# EAGLE design 7segement4digits1badidea-huge-digits-mk-1.1 (EAGLE 7.5.0)
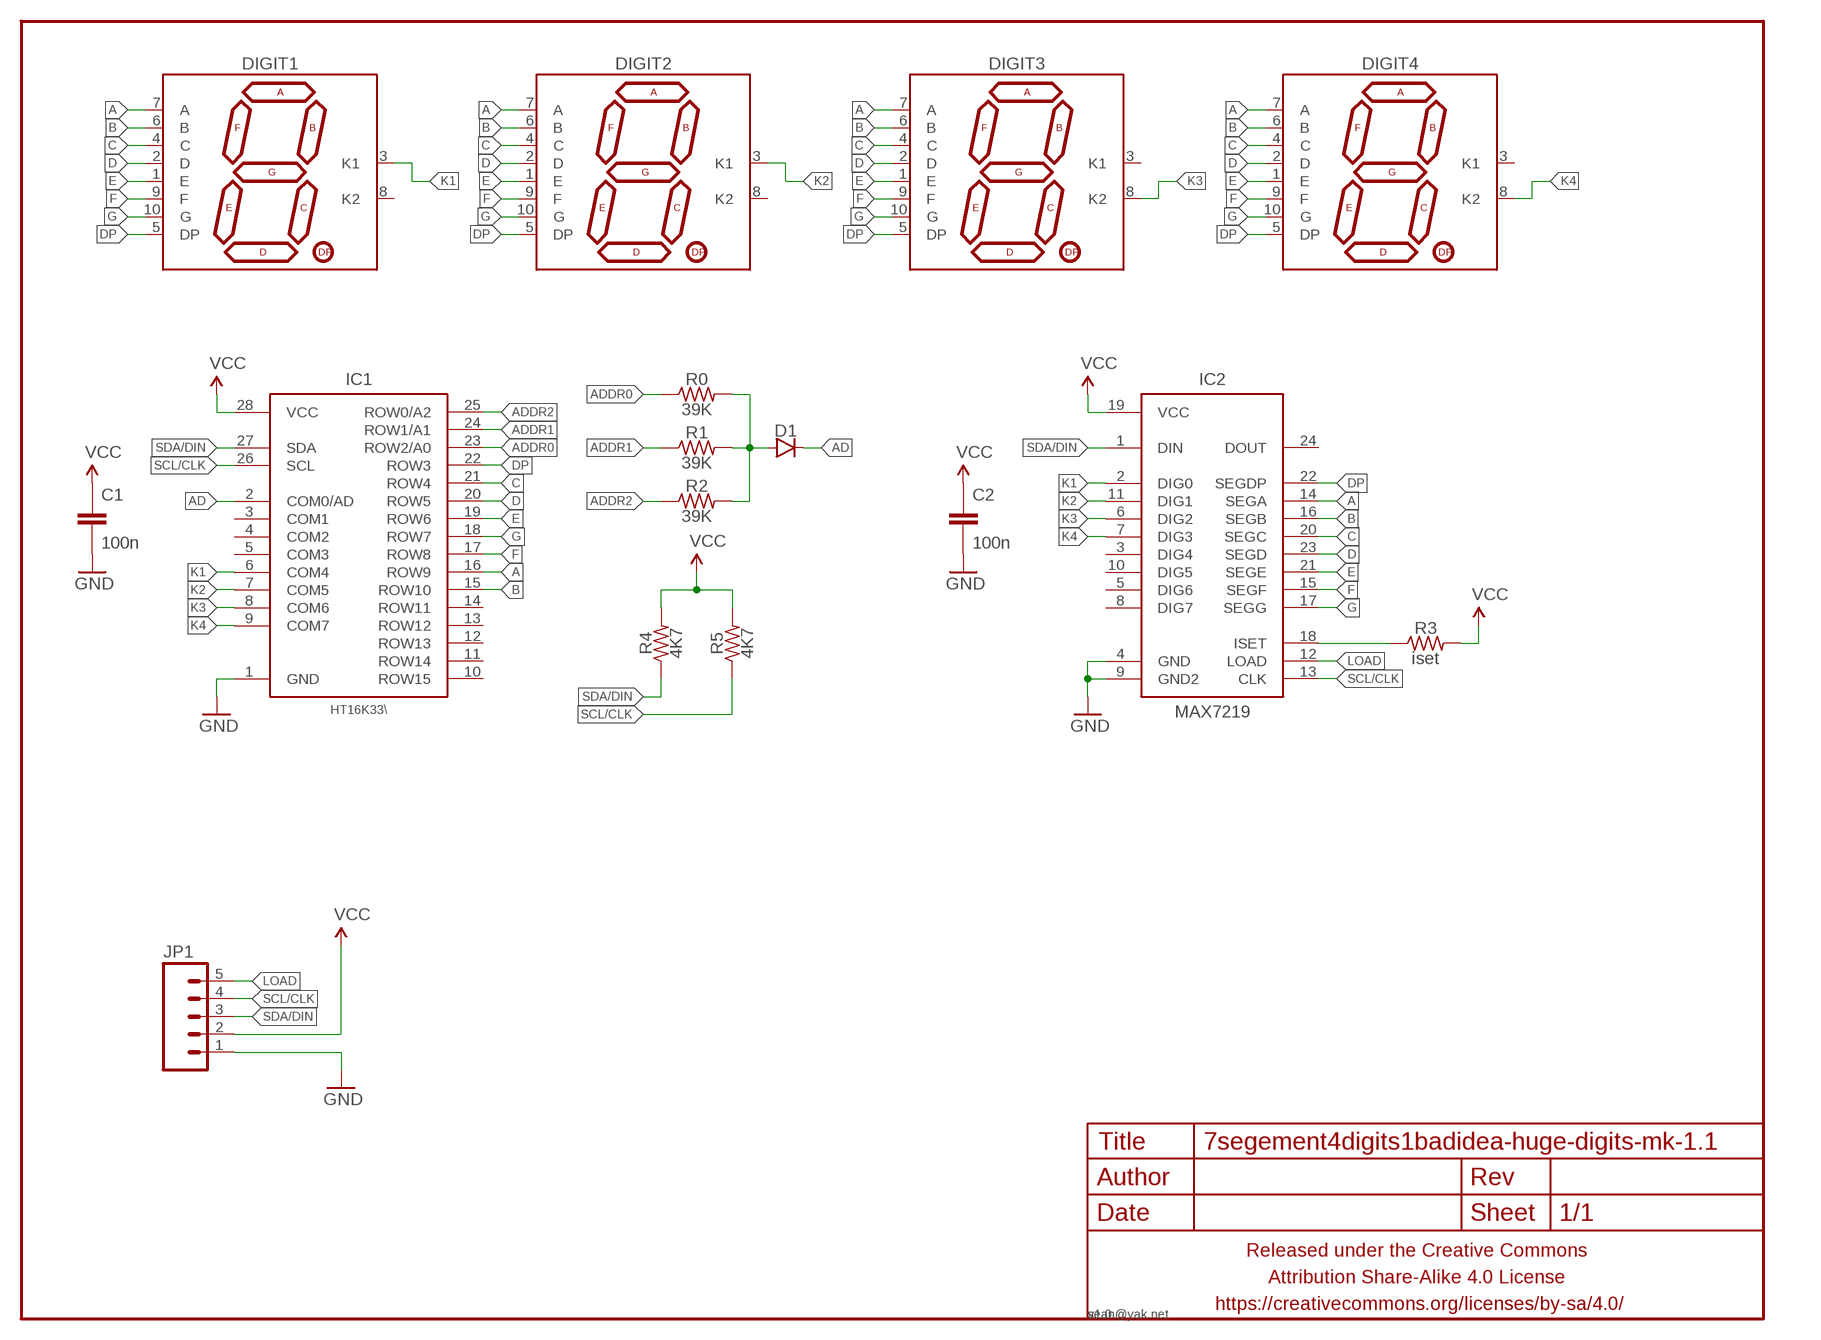
[diagram p0: schematic, sheet 1]

## Parts
C1  100n  CAPACITOR-CERAMICC0805  [C0805]
C2  100n  CAPACITOR-CERAMICC0805  [C0805]
D1  DIODESOD123  [SOD123]
DIGIT1  7SEG_1DIGPTH-25.4MM  [7SEG_1DIG_25.4MM]
DIGIT2  7SEG_1DIGPTH-25.4MM  [7SEG_1DIG_25.4MM]
DIGIT3  7SEG_1DIGPTH-25.4MM  [7SEG_1DIG_25.4MM]
DIGIT4  7SEG_1DIGPTH-25.4MM  [7SEG_1DIG_25.4MM]
FRAME1  FRAME-LETTERNO_PACKAGE  [DUMMY]
IC1  HT16K33\  HT16K33-28SOIC28W  [SOIC28W]
IC2  MAX7219  MAX7219SOIC-W  [SO24W]
JP1  M05PTH-CENTERED  [1X05_PTH_CENTERED]
R0  39K  RESISTORR0805  [R0805]
R1  39K  RESISTORR0805  [R0805]
R2  39K  RESISTORR0805  [R0805]
R3  iset  RESISTORR0805  [R0805]
R4  4K7  RESISTORR0805  [R0805]
R5  4K7  RESISTORR0805  [R0805]

## Nets
A: DIGIT1.7(A) DIGIT2.7(A) DIGIT3.7(A) DIGIT4.7(A) IC1.16(ROW9) IC2.14(SEGA)
AD: D1.C IC1.2(COM0/AD)
ADDR0: IC1.23(ROW2/A0) R0.1
ADDR1: IC1.24(ROW1/A1) R1.1
ADDR2: IC1.25(ROW0/A2) R2.1
B: DIGIT1.6(B) DIGIT2.6(B) DIGIT3.6(B) DIGIT4.6(B) IC1.15(ROW10) IC2.16(SEGB)
C: DIGIT1.4(C) DIGIT2.4(C) DIGIT3.4(C) DIGIT4.4(C) IC1.21(ROW4) IC2.20(SEGC)
D: DIGIT1.2(D) DIGIT2.2(D) DIGIT3.2(D) DIGIT4.2(D) IC1.20(ROW5) IC2.23(SEGD)
DP: DIGIT1.5(DP) DIGIT2.5(DP) DIGIT3.5(DP) DIGIT4.5(DP) IC1.22(ROW3) IC2.22(SEGDP)
E: DIGIT1.1(E) DIGIT2.1(E) DIGIT3.1(E) DIGIT4.1(E) IC1.19(ROW6) IC2.21(SEGE)
F: DIGIT1.9(F) DIGIT2.9(F) DIGIT3.9(F) DIGIT4.9(F) IC1.17(ROW8) IC2.15(SEGF)
G: DIGIT1.10(G) DIGIT2.10(G) DIGIT3.10(G) DIGIT4.10(G) IC1.18(ROW7) IC2.17(SEGG)
GND: C1.2 C2.2 IC1.1(GND) IC2.4(GND) IC2.9(GND2) JP1.1
K1: DIGIT1.3(K1) IC1.6(COM4) IC2.2(DIG0)
K2: DIGIT2.3(K1) IC1.7(COM5) IC2.11(DIG1)
K3: DIGIT3.8(K2) IC1.8(COM6) IC2.6(DIG2)
K4: DIGIT4.8(K2) IC1.9(COM7) IC2.7(DIG3)
LOAD: IC2.12(LOAD) JP1.5
N$1: IC2.18(ISET) R3.1
N$2: D1.A R0.2 R1.2 R2.2
SCL/CLK: IC1.26(SCL) IC2.13(CLK) JP1.4 R5.1
SDA/DIN: IC1.27(SDA) IC2.1(DIN) JP1.3 R4.1
VCC: C1.1 C2.1 IC1.28(VCC) IC2.19(VCC) JP1.2 R3.2 R4.2 R5.2
Unconnected: DIGIT1.8(K2) DIGIT2.8(K2) DIGIT3.3(K1) DIGIT4.3(K1) IC1.3(COM1) IC1.4(COM2) IC1.5(COM3) IC1.10(ROW15) IC1.11(ROW14) IC1.12(ROW13) IC1.13(ROW12) IC1.14(ROW11) IC2.3(DIG4) IC2.5(DIG6) IC2.8(DIG7) IC2.10(DIG5) IC2.24(DOUT)

## Library data of the parts
C1 C2 = a_parts:CAPACITOR-CERAMIC: CAPACITOR, European symbol
D1 = a_parts:DIODE: Diode These are standard reverse protection diodes and small signal diodes. SMA package can handle up to about 1A. SOD-323 can handle about 200mA. What the SOD-323 package when ordering, there are some mfgs out there that are 5-pin packages.
DIGIT1-DIGIT4 = A_butts:7SEG_1DIG
FRAME1 = A_butts:FRAME-LETTER: Schematic Frame Standard 8.5x11 US Letter frame; DESIGNER: sean@yak.net; VERSION: v1.0
IC1 = a_parts:HT16K33-28
IC2 = a_parts:MAX7219: 8-digit, 8-segment LED display driver, serial input
JP1 = a_parts:M05: Header 5 Standard 5-pin 0.1" header. Use with straight break away headers (SKU : PRT-00116), right angle break away headers (PRT-00553), swiss pins (PRT-00743), machine pins (PRT-00117), and female headers (PRT-00115). Molex polarized connector foot print use with SKU : PRT-08230 with associated crimp pins and housings.
R0 R1-R5 = a_parts:RESISTOR: RESISTOR, American symbol

## Board
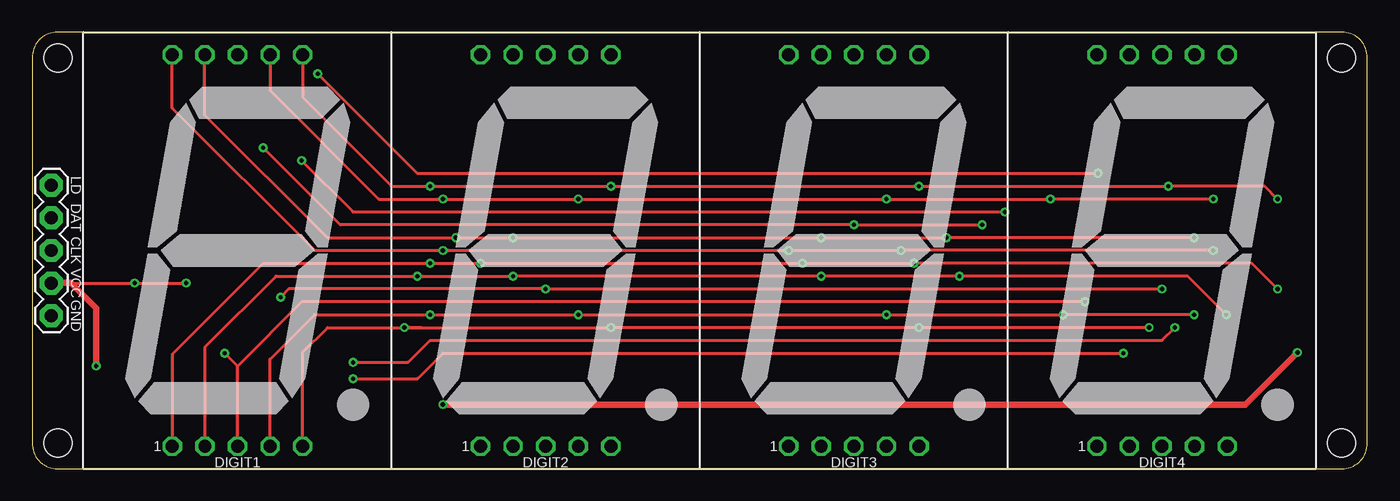
[diagram p1: board, top side]
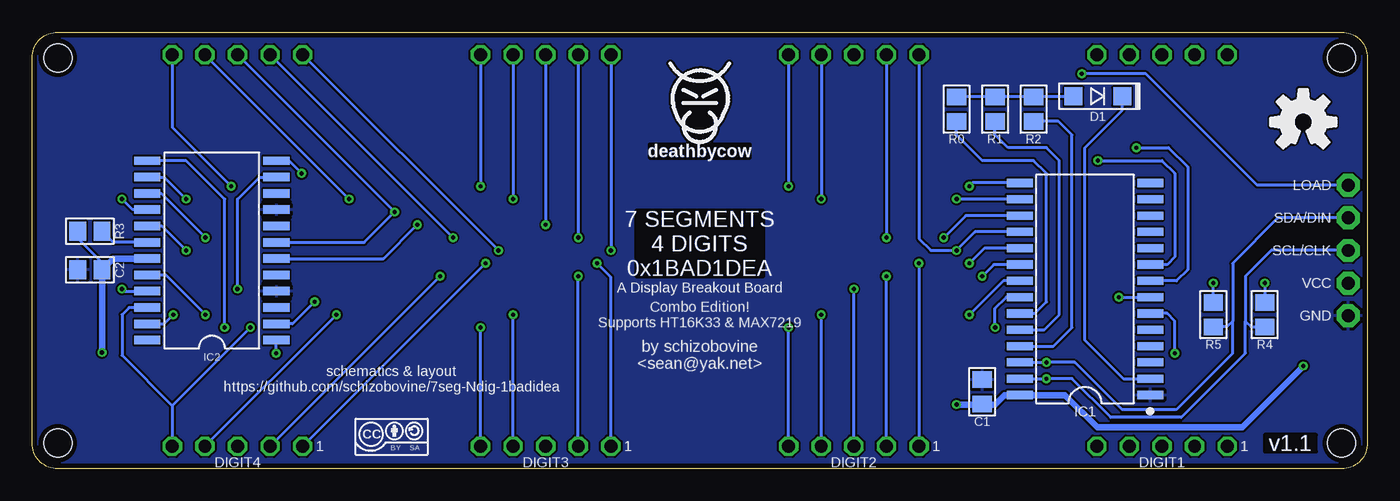
[diagram p2: board, bottom side, seen from below]

Size 104 x 34 mm. Coordinates in mm from the lower left corner, seen from the top.
Outline: 0,32 0,2 arc90 2,0 102,0 arc90 104,2 104,32 arc90 102,34 2,34 arc90 0,32
Copper layers (1*16): Top 0.0356mm / dielectric 1.5011mm / Bottom 0.0356mm
Design rules "LaenPCBOrder2": minimum track width 6mil, minimum drill 13mil, track to track 6mil, track to pad 6mil, pad to pad 6mil, via to via 6mil, smd to smd 6mil, copper to edge 15mil, drill to drill 6mil, minimum pad ring 7mil, minimum via ring 7mil, stop-mask expansion 3mil, vias tented up to drill 20mil, thermal gap 10mil
Holes 2.2 mm at 2,2 102,2 102,32 2,32
bRestrict: 4 lines

### Footprints (pad centres in the part's own frame; a part is rotated, then mirrored left to right if it is on the bottom)
C0805 = smd 1.3 x 1.5: 1 -0.95,0; 2 0.95,0
SOD123 = smd 1.4 x 1.4: A 1.9,0; C -1.9,0
7SEG_1DIG_25.4MM = drill 1 pad 1.5 octagon: 1 -5.08,-15.24; 2 -2.54,-15.24; 3 0,-15.24; 4 2.54,-15.24; 5 5.08,-15.24; 6 5.08,15.24; 7 2.54,15.24; 8 0,15.24; 9 -2.54,15.24; 10 -5.08,15.24
SOIC28W = smd 0.635 x 2.032: 1 -8.255,-5.08; 2 -6.985,-5.08; 3 -5.715,-5.08; 4 -4.445,-5.08; 5 -3.175,-5.08; 6 -1.905,-5.08; 7 -0.635,-5.08; 8 0.635,-5.08; 9 1.905,-5.08; 10 3.175,-5.08; 11 4.445,-5.08; 12 5.715,-5.08; 13 6.985,-5.08; 14 8.255,-5.08; 15 8.255,5.08; 16 6.985,5.08; 17 5.715,5.08; 18 4.445,5.08; 19 3.175,5.08; 20 1.905,5.08; 21 0.635,5.08; 22 -0.635,5.08; 23 -1.905,5.08; 24 -3.175,5.08; 25 -4.445,5.08; 26 -5.715,5.08; 27 -6.985,5.08; 28 -8.255,5.08
SO24W = smd 0.66 x 2.032: 1 -6.985,-5.029; 2 -5.715,-5.029; 3 -4.445,-5.029; 4 -3.175,-5.029; 5 -1.905,-5.029; 6 -0.635,-5.029; 7 0.635,-5.029; 8 1.905,-5.029; 9 3.175,-5.029; 10 4.445,-5.029; 11 5.715,-5.029; 12 6.985,-5.029; 13 6.985,5.029; 14 5.715,5.029; 15 4.445,5.029; 16 3.175,5.029; 17 1.905,5.029; 18 0.635,5.029; 19 -0.635,5.029; 20 -1.905,5.029; 21 -3.175,5.029; 22 -4.445,5.029; 23 -5.715,5.029; 24 -6.985,5.029
1X05_PTH_CENTERED = drill 1 pad 1.778 octagon: 1 -5.08,0; 2 -2.54,0; 3 0,0; 4 2.54,0; 5 5.08,0
R0805 = smd 1.3 x 1.5: 1 -0.95,0; 2 0.95,0

### Placement (x,y rotation side)
C1  30,6 90 bottom
C2  99.5,15.5 180 bottom
D1  21,29 180 bottom
DIGIT1  16,17 0 top
DIGIT2  40,17 0 top
DIGIT3  64,17 0 top
DIGIT4  88,17 0 top
FRAME1  0,0 0 top
IC1  22,14 90 bottom
IC2  90,17 90 bottom
JP1  1.5,17 90 top
R0  32,28 90 bottom
R1  29,28 90 bottom
R2  26,28 90 bottom
R3  99.5,18.5 180 bottom
R4  8,12 90 bottom
R5  12,12 90 bottom
U$1  [CC-BY-SA-4.0-NO-URL]  76,2.5 0 bottom
U$2  [COW_SMALL_METAL]  52,29 0 bottom
U$3  [OSHWLOGO_TOP_0.2_A]  5,27 0 bottom

### Tracks (layer width: path | path; a pad name or v marks a point on that pad's centre or on a via)
A  (via drill 0.33)
  Top 0.25: DIGIT1.7 18.54,29.46 27,21 v32,21 v42.54,21 v66.54,21 v79.3,21 v92,21
  Bottom 0.25: DIGIT4.7 v79.3,21 | DIGIT3.7 v66.54,21 | DIGIT2.7 v42.54,21 | IC1.16 31.98,20.98 v32,21 | IC2.14 93.72,22.71 v92,21
AD
  Bottom 0.25: IC1.2 19.02,7.01 22,10 22,25 19.1,27.9 D1.C
ADDR0
  Bottom 0.25: IC1.23 25.91,12.1 25,13 25,23 26,24 30,24 32,26 R0.1
ADDR1
  Bottom 0.25: IC1.24 25.18,10.82 24,12 24,24 25,25 28,25 29,26 R1.1
ADDR2
  Bottom 0.25: IC1.25 24.45,9.55 23,11 23,26 24.05,27.05 R2.1
B  (via drill 0.33)
  Top 0.25: DIGIT1.6 21.08,28.92 28,22 v31,22 v45.08,22 v69.08,22 v88.5,22 96,22 v97,21
  Bottom 0.25: DIGIT4.6 93.08,26.58 v88.5,22 | DIGIT3.6 v69.08,22 | DIGIT2.6 v45.08,22 | IC1.15 30.75,22.25 v31,22 | IC2.16 96.17,20.18 v97,21
C  (via drill 0.33)
  Top 0.25: DIGIT1.4 18.54,8.54 22,12 v31,12 v42.54,12 v66.54,12 v80.3,12 v90.5,12
  Bottom 0.25: DIGIT4.4 v80.3,12 | DIGIT3.4 v66.54,12 | DIGIT2.4 v42.54,12 | IC1.21 28.36,14.63 v31,12 | IC2.20 93.59,15.1 v90.5,12
D  (via drill 0.33)
  Top 0.25: DIGIT1.2 13.46,9.46 19,15 v30,15 v37.46,15 v61.46,15 v72.22,15 90,15 v93,12
  Bottom 0.25: DIGIT3.2 v61.46,15 | DIGIT2.2 v37.46,15 | IC1.20 29.09,15.9 v30,15 | v72.22,15 DIGIT4.2 | IC2.23 93.72,11.29 v93,12
DP  (via drill 0.33)
  Top 0.25: 30.32,11 v29,11 | v29,11 v45.08,11 v69.08,11 v87,11 | DIGIT1.5 21.08,9.08 23,11 v29,11
  Bottom 0.25: DIGIT3.5 v69.08,11 | DIGIT2.5 v45.08,11 | v29,11 29,12.5 28.14,13.37 IC1.22 | v87,11 93.08,4.92 | 93.08,4.92 DIGIT4.5 | IC2.22 96.44,12.55 97,12 97,8.84 93.08,4.92
E  (via drill 0.33)
  Top 0.25: DIGIT1.1 10.92,8.92 18,16 v31,16 v34.92,16 v60,16 v68.68,16 95,16 v97,14
  Bottom 0.25: DIGIT4.1 v68.68,16 | v34.92,16 DIGIT2.1 | IC1.19 29.82,17.18 v31,16 | DIGIT3.1 58.92,14.92 v60,16 | v97,14 96.83,13.82 IC2.21
F  (via drill 0.33)
  Top 0.25: DIGIT1.9 13.46,27.54 23,18 v33,18 v37.46,18 v61.46,18 v71.22,18 v90.5,18
  Bottom 0.25: DIGIT4.9 v71.22,18 | DIGIT3.9 v61.46,18 | DIGIT2.9 v37.46,18 | IC1.17 31.29,19.71 v33,18 | IC2.15 93.94,21.45 v90.5,18
G  (via drill 0.33)
  Top 0.25: DIGIT1.10 10.92,28.08 22,17 v32,17 v58.92,17 v67.68,17 v92,17
  Bottom 0.25: DIGIT4.10 v67.68,17 | DIGIT3.10 v58.92,17 | IC1.18 30.55,18.45 v32,17 34,17 34.92,17.92 DIGIT2.10 | IC2.17 93.91,18.91 v92,17
GND
  pour Bottom (rank 6): 2,34 102,34 arc-90 104,32 104,2 arc-90 102,0 2,0 arc-90 0,2 0,32 arc-90
K1  (via drill 0.33)
  Top 0.25: v82,13 21,13 16,8 | DIGIT1.3 16,8 | v15,9 16,8
  Bottom 0.25: v15,9 15,11.5 15.6,12.1 IC1.6 | v82,13 83.72,11.29 IC2.2
K2  (via drill 0.33)
  Top 0.25: v19.36,13.37 20,14 v40,14 v88,14
  Bottom 0.25: DIGIT2.3 v40,14 | v19.36,13.37 IC1.7 | v88,14 88,21 86.28,22.71 IC2.11
K3  (via drill 0.33)
  Top 0.25: v18,25 24,19 v64,19 v74,19
  Bottom 0.25: DIGIT3.8 v64,19 | v18,25 15.5,25 14,23.5 14,15.5 14.87,14.63 IC1.8 | IC2.6 76.64,16.36 v74,19
K4  (via drill 0.33)
  Top 0.25: v75.76,20 25,20 v21,24
  Bottom 0.25: DIGIT4.8 v75.76,20 78.12,17.64 IC2.7 | v21,24 16,24 15,23 15,16.5 15.6,15.9 IC1.9
LOAD  (via drill 0.33)
  Top 0.25: v22.25,30.75 30,23 v83,23
  Bottom 0.25: JP1.5 8.58,22.08 17.25,30.75 v22.25,30.75 | 84.99,24 IC2.12 83.98,23.98 v83,23
N$1
  Bottom 0.25: IC2.18 97.69,17.64 R3.1
N$2
  Bottom 0.25: D1.A 22.95,28.95 R2.2 R1.2 R0.2
SCL/CLK  (via drill 0.33)
  Top 0.25: v25,8.29 29.29,8.29 31,10 88,10 v89,11
  Bottom 0.25: 10.5,11.5 10.5,16 6.96,19.54 JP1.4 | 10.5,11.5 10.95,11.05 R5.1 | IC1.26 v25,8.29 22.79,8.29 19.1,4.6 14.9,4.6 10.5,9 10.5,11.5 | v89,11 89,21 92,24 95.01,24 IC2.13
SDA/DIN  (via drill 0.33)
  Top 0.25: v25,7.01 30.02,7.01 32,9 v85,9
  Bottom 0.25: IC1.27 v25,7.01 23.02,7.01 20,4 14.5,4 9.5,9 9.5,11.5 | JP1.3 7.5,17 9.5,15 9.5,11.5 | 9.5,11.5 9.05,11.05 R4.1 | v85,9 85,9.99 IC2.1
VCC  (via drill 0.33)
  Top 0.25: JP1.2 v8,14.46 v12,14.46
  Top 0.5: v32,5 94.5,5 v98.55,9.05 | JP1.2 1.54,14.5 3,14.5 5,12.5 v5,8
  Bottom 0.25: v8,14.46 R4.2 | R5.2 v12,14.46 | R3.2 100.45,17.95 98.55,16.05 C2.1
  Bottom 0.4: C1.1 30.05,5
  Bottom 0.5: C1.1 29.95,5 29,5 28.25,5.75 IC1.28 23.55,5.75 21.05,3.25 9.75,3.25 v5,8 | 30.05,5 v32,5 | v98.55,9.05 C2.1 97.69,16.36 IC2.19

### Text on the board
Bottom: 7 SEGMENTS / 4 DIGITS / 0x1BAD1DEA
bPlace: 7 SEGMENTS / 4 DIGITS / 0x1BAD1DEA | A Display Breakout Board | Combo Edition! / Supports HT16K33 & MAX7219 | by schizobovine / <sean@yak.net> | schematics & layout / https://github.com/schizobovine/7seg-Ndig-1badidea
tNames: LD | DAT | CLK | VCC | GND
bNames: LOAD | SDA/DIN | SCL/CLK | VCC | GND